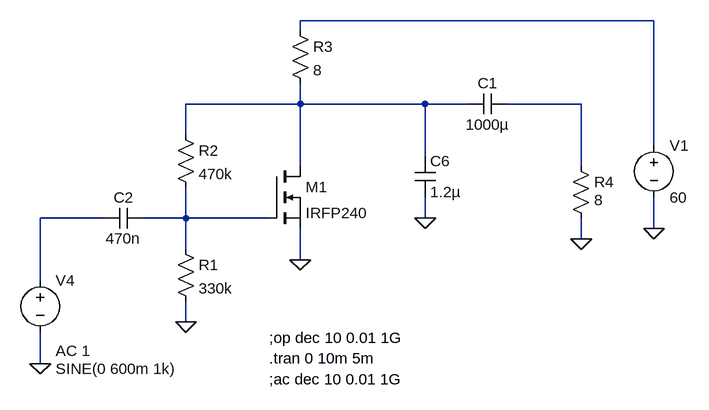
[diagram p0: schematic Power Amplifier.asc]
Power Amplifier.asc, the LTspice schematic file:
Version 4
SHEET 1 1916 680
WIRE 1808 -256 1264 -256
WIRE 1264 -240 1264 -256
WIRE 1264 -128 1264 -160
WIRE 1264 -128 1088 -128
WIRE 1456 -128 1264 -128
WIRE 1520 -128 1456 -128
WIRE 1696 -128 1584 -128
WIRE 1088 -80 1088 -128
WIRE 1808 -64 1808 -256
WIRE 1456 -48 1456 -128
WIRE 1264 -32 1264 -128
WIRE 1696 -32 1696 -128
WIRE 960 48 864 48
WIRE 1088 48 1088 0
WIRE 1088 48 1024 48
WIRE 1216 48 1088 48
WIRE 1456 48 1456 16
WIRE 1808 64 1808 16
WIRE 1696 80 1696 48
WIRE 1088 96 1088 48
WIRE 1264 112 1264 64
WIRE 864 144 864 48
WIRE 1088 208 1088 176
WIRE 864 272 864 224
FLAG 1088 208 0
FLAG 1264 112 0
FLAG 1456 48 0
FLAG 1808 64 0
FLAG 1696 80 0
FLAG 864 272 0
SYMBOL cap 1024 32 R90
WINDOW 0 0 32 VBottom 2
WINDOW 3 32 32 VTop 2
SYMATTR InstName C2
SYMATTR Value 470n
SYMBOL res 1072 80 R0
SYMATTR InstName R1
SYMATTR Value 330k
SYMBOL nmos 1216 -32 R0
SYMATTR InstName M1
SYMATTR Value IRFP240
SYMBOL res 1072 -96 R0
SYMATTR InstName R2
SYMATTR Value 470k
SYMBOL res 1248 -256 R0
SYMATTR InstName R3
SYMATTR Value 8
SYMBOL cap 1440 -48 R0
SYMATTR InstName C6
SYMATTR Value 1.2µ
SYMBOL cap 1584 -144 R90
WINDOW 0 0 32 VBottom 2
WINDOW 3 32 32 VTop 2
SYMATTR InstName C1
SYMATTR Value 1000µ
SYMBOL res 1680 -48 R0
WINDOW 3 36 68 Left 2
SYMATTR InstName R4
SYMATTR Value 8
SYMBOL voltage 1808 -80 R0
SYMATTR InstName V1
SYMATTR Value 60
SYMBOL voltage 864 128 R0
WINDOW 3 24 152 Left 2
WINDOW 123 24 124 Left 2
WINDOW 39 0 0 Left 0
SYMATTR Value SINE(0 600m 1k)
SYMATTR Value2 AC 1
SYMATTR InstName V4
TEXT 1216 296 Left 2 !;ac dec 10 0.01 1G
TEXT 1216 264 Left 2 !.tran 0 10m 5m
TEXT 1216 232 Left 2 !;op dec 10 0.01 1G

The netlist it stands for:
* Power Amplifier.asc
C2 N005 N004 470n
R1 N005 0 330k
M1 N002 N005 0 0 IRFP240
R2 N002 N005 470k
R3 N001 N002 8
C6 N002 0 1.2µ
C1 N003 N002 1000µ
R4 N003 0 8
V1 N001 0 60
V4 N004 0 SINE(0 600m 1k) AC 1
.model NMOS NMOS
.model PMOS PMOS
.lib standard.mos
;ac dec 10 0.01 1G
.tran 0 10m 5m
;op dec 10 0.01 1G
.backanno
.end